# Altium project stm32f205.PrjPcb
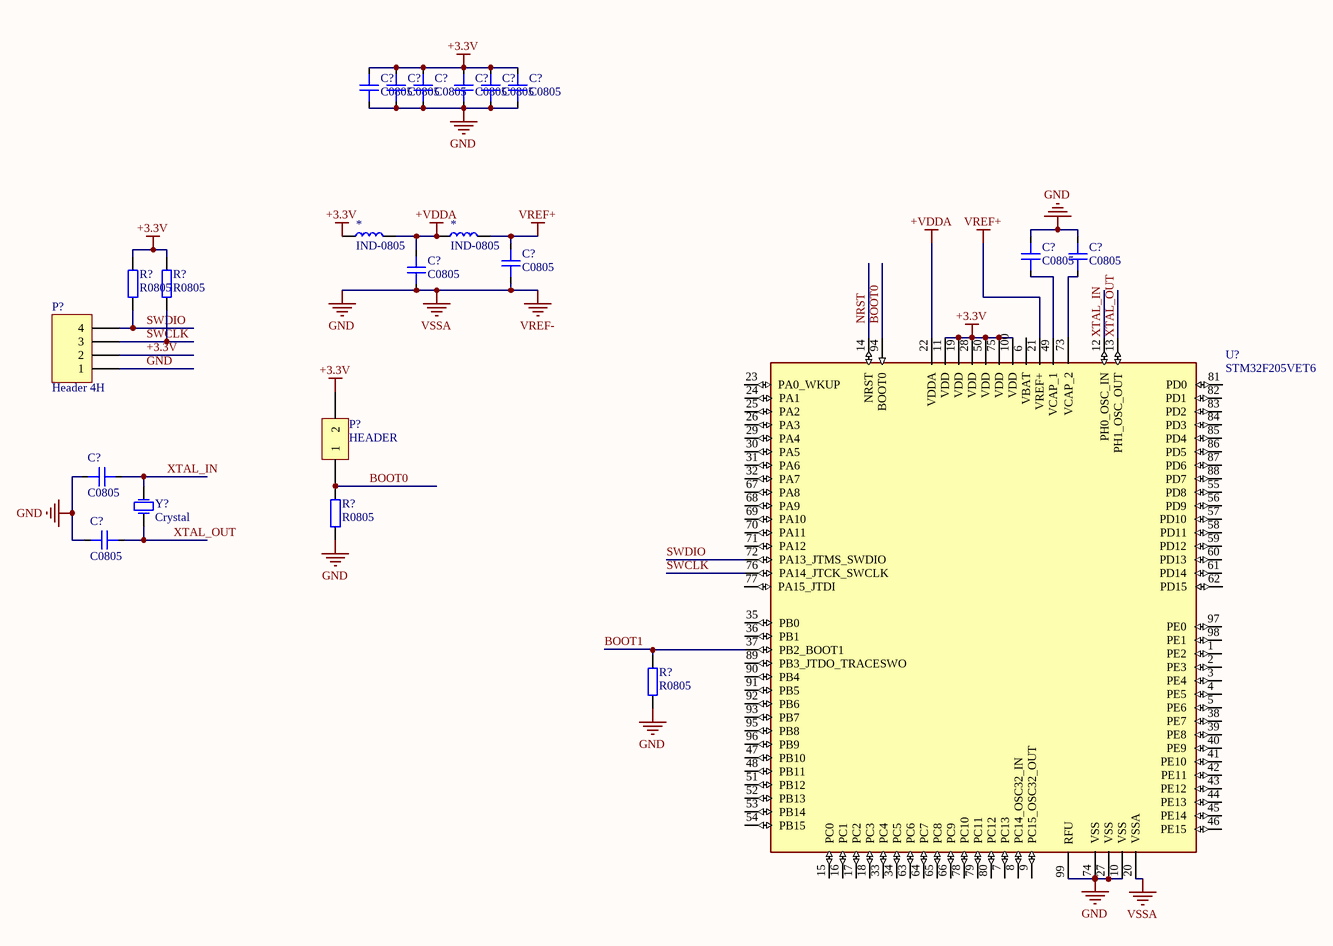
[diagram p0: Sheet2.SchDoc]
1 sheet, 22 parts. Net scope: global (net labels, ports and power ports of the same name join across sheets).

## Sheet Sheet2.SchDoc
size C; SheetNumber: 1; SheetTotal: 1

### Parts
(Parts that share a designator on the sheet are numbered #1, #2 ... from top to bottom, then left to right.)
*#1  IND-0805  [INDUCTOR 0805]
*#2  IND-0805  [INDUCTOR 0805]
C?#1  C0805  [CAP_0805]
C?#2  C0805  [CAP_0805]
C?#3  C0805  [CAP_0805]
C?#4  C0805  [CAP_0805]
C?#5  C0805  [CAP_0805]
C?#6  C0805  [CAP_0805]
C?#7  C0805  [CAP_0805]
C?#8  C0805  [CAP_0805]
C?#9  C0805  [CAP_0805]
C?#10  C0805  [CAP_0805]
C?#11  C0805  [CAP_0805]
C?#12  C0805  [CAP_0805]
P?#1  Header 4H  [HDR1X4]
P?#2  HEADER  [JUMPER PITCH 2 PIN]
R?#1  R0805  [RES_0805]
R?#2  R0805  [RES_0805]
R?#3  R0805  [RES_0805]
R?#4  R0805  [RES_0805]
U?  STM32F205VET6  [STM32F205]
Y?  Crystal  [CRYSTAL DIP]

### Nets
+3.3V: *#1.1 C?#1.2 C?#2.2 C?#3.2 C?#4.2 C?#5.2 C?#6.2 P?#1.2 P?#2.2 R?#1.2 R?#2.2 U?.11(VDD) U?.19(VDD) U?.28(VDD) U?.50(VDD) U?.75(VDD) U?.100(VDD)
+VDDA: *#1.2 *#2.1 C?#10.2 U?.22(VDDA)
GND: C?#1.1 C?#2.1 C?#3.1 C?#4.1 C?#5.1 C?#6.1 C?#7.2 C?#8.2 C?#9.1 C?#10.1 C?#11.1 C?#12.1 P?#1.1 R?#3.1 R?#4.1 U?.10(VSS) U?.20(VSSA) U?.27(VSS) U?.74(VSS) U?.99(RFU)  [also labelled VREF-, VSSA]
VREF+: *#2.2 C?#9.2 U?.21(VREF+)
BOOT0: P?#2.1 R?#3.2 U?.94(BOOT0)
BOOT1: R?#4.2 U?.37(PB2_BOOT1)
NRST: U?.14(NRST)
SWCLK: P?#1.3 R?#2.1 U?.76(PA14_JTCK_SWCLK)
SWDIO: P?#1.4 R?#1.1 U?.72(PA13_JTMS_SWDIO)
XTAL_IN: C?#11.2 U?.12(PH0_OSC_IN) Y?.2(OSC2)
XTAL_OUT: C?#12.2 U?.13(PH1_OSC_OUT) Y?.1(OSC1)
NetC?#7_1: C?#7.1 U?.49(VCAP_1)
NetC?#8_1: C?#8.1 U?.73(VCAP_2)

Not connected (* = marked no-connect by the designer): U? 1(PE2) 2(PE3) 3(PE4) 4(PE5) 5(PE6) 6(VBAT) 7(PC13) 8(PC14_OSC32_IN) 9(PC15_OSC32_OUT) 15(PC0) 16(PC1) 17(PC2) 18(PC3) 23(PA0_WKUP) 24(PA1) 25(PA2) 26(PA3) 29(PA4) 30(PA5) 31(PA6) 32(PA7) 33(PC4) 34(PC5) 35(PB0) 36(PB1) 38(PE7) 39(PE8) 40(PE9) 41(PE10) 42(PE11) 43(PE12) 44(PE13) 45(PE14) 46(PE15) 47(PB10) 48(PB11) 51(PB12) 52(PB13) 53(PB14) 54(PB15) 55(PD8) 56(PD9) 57(PD10) 58(PD11) 59(PD12) 60(PD13) 61(PD14) 62(PD15) 63(PC6) 64(PC7) 65(PC8) 66(PC9) 67(PA8) 68(PA9) 69(PA10) 70(PA11) 71(PA12) 77(PA15_JTDI) 78(PC10) 79(PC11) 80(PC12) 81(PD0) 82(PD1) 83(PD2) 84(PD3) 85(PD4) 86(PD5) 87(PD6) 88(PD7) 89(PB3_JTDO_TRACESWO) 90(PB4) 91(PB5) 92(PB6) 93(PB7) 95(PB8) 96(PB9) 97(PE0) 98(PE1)

### Library data of the parts
C?#1-C?#12 = CAP_0805: Capacitor SMD 0805; Manufacturer: *; Manufacturer Part Number: *; Distributor Link: *; LCSC: *; Rating: *; Dielectric: *
P?#2 = HEADER CONNECT
R?#1-R?#4 = RES_0805: Resistor SMD 0805; Manufacturer: *; Manufacturer Part Number: *; Distributor Link: *; LCSC: *
U? = STM32F205VET6: ARMÂ® CortexÂ®-M3 STM32F2 Microcontroller IC 32-Bit Single-Core 120MHz 512KB (512K x 8) FLASH 100-LQFP (14x14); MF: STMicroelectronics; SnapEDA_Link: https://www.snapeda.com/parts/STM32F205VET6/STMicroelectronics/view-part/?ref=snap; Package: LQFP-100 STMicroelectronics; Value: *; MP: STM32F205VET6; Check_prices: https://www.snapeda.com/parts/STM32F205VET6/STMicroelectronics/view-part/?ref=eda
P?#1 = Header 4H: LatestRevisionDate: 17-Jul-2002; LatestRevisionNote: Re-released for DXP Platform.; Publisher: Altium Limited
Y? = Crystal: Published: 8-Jun-2000; LatestRevisionDate: 17-Jul-2002; LatestRevisionNote: Re-released for DXP Platform.; PackageReference: R38; Publisher: Altium Limited